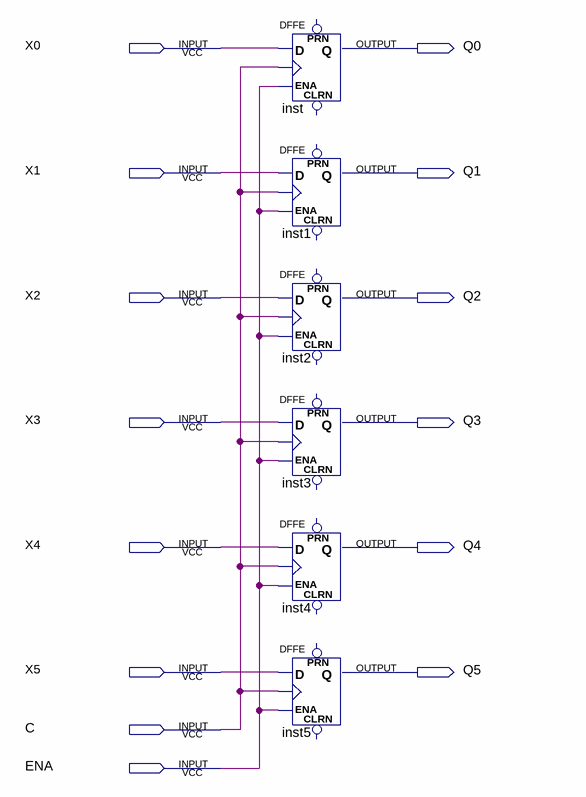
[diagram p0: schematic sheet]
// Quartus schematic lab1.bdf as structural Verilog: 6 symbols, 14 pins
module lab1 (
  input  X0,
  input  X1,
  input  X2,
  input  X3,
  input  X4,
  input  X5,
  input  C,
  input  ENA,
  output Q0,
  output Q1,
  output Q2,
  output Q3,
  output Q4,
  output Q5
);

  DFFE inst (.D(X0), .CLK(C), .ENA(ENA), .Q(Q0));  // open: PRN, CLRN
  DFFE inst1 (.D(X1), .CLK(C), .ENA(ENA), .Q(Q1));  // open: PRN, CLRN
  DFFE inst2 (.D(X2), .CLK(C), .ENA(ENA), .Q(Q2));  // open: PRN, CLRN
  DFFE inst3 (.D(X3), .CLK(C), .ENA(ENA), .Q(Q3));  // open: PRN, CLRN
  DFFE inst4 (.D(X4), .CLK(C), .ENA(ENA), .Q(Q4));  // open: PRN, CLRN
  DFFE inst5 (.D(X5), .CLK(C), .ENA(ENA), .Q(Q5));  // open: PRN, CLRN
endmodule
